# Altium schematic sheet EC800ECNNQ-N03-SNNSA1_EC800ECNNQ-N03-SNNSA.schdoc
size 127 x 152 mm
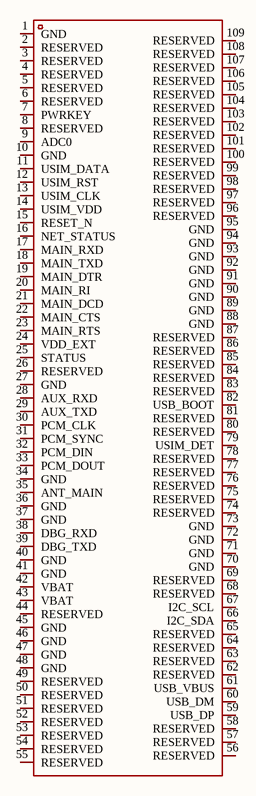
[diagram p0: EC800ECNNQ-N03-SNNSA1_EC800ECNNQ-N03-SNNSA.schdoc]

## Parts
U?  EC800ECNNQ-N03-SNNSA  [LCC-LGA-109_L17.7-W15.8-P1.10_MC661]  (value not drawn)

## Nets

Not connected (* = marked no-connect by the designer): U? 1(GND) 2(RESERVED) 3(RESERVED) 4(RESERVED) 5(RESERVED) 6(RESERVED) 7(PWRKEY) 8(RESERVED) 9(ADC0) 10(GND) 11(USIM_DATA) 12(USIM_RST) 13(USIM_CLK) 14(USIM_VDD) 15(RESET_N) 16(NET_STATUS) 17(MAIN_RXD) 18(MAIN_TXD) 19(MAIN_DTR) 20(MAIN_RI) 21(MAIN_DCD) 22(MAIN_CTS) 23(MAIN_RTS) 24(VDD_EXT) 25(STATUS) 26(RESERVED) 27(GND) 28(AUX_RXD) 29(AUX_TXD) 30(PCM_CLK) 31(PCM_SYNC) 32(PCM_DIN) 33(PCM_DOUT) 34(GND) 35(ANT_MAIN) 36(GND) 37(GND) 38(DBG_RXD) 39(DBG_TXD) 40(GND) 41(GND) 42(VBAT) 43(VBAT) 44(RESERVED) 45(GND) 46(GND) 47(GND) 48(GND) 49(RESERVED) 50(RESERVED) 51(RESERVED) 52(RESERVED) 53(RESERVED) 54(RESERVED) 55(RESERVED) 56(RESERVED) 57(RESERVED) 58(RESERVED) 59(USB_DP) 60(USB_DM) 61(USB_VBUS) 62(RESERVED) 63(RESERVED) 64(RESERVED) 65(RESERVED) 66(I2C_SDA) 67(I2C_SCL) 68(RESERVED) 69(RESERVED) 70(GND) 71(GND) 72(GND) 73(GND) 74(RESERVED) 75(RESERVED) 76(RESERVED) 77(RESERVED) 78(RESERVED) 79(USIM_DET) 80(RESERVED) 81(RESERVED) 82(USB_BOOT) 83(RESERVED) 84(RESERVED) 85(RESERVED) 86(RESERVED) 87(RESERVED) 88(GND) 89(GND) 90(GND) 91(GND) 92(GND) 93(GND) 94(GND) 95(GND) 96(RESERVED) 97(RESERVED) 98(RESERVED) 99(RESERVED) 100(RESERVED) 101(RESERVED) 102(RESERVED) 103(RESERVED) 104(RESERVED) 105(RESERVED) 106(RESERVED) 107(RESERVED) 108(RESERVED) 109(RESERVED)

## Library data of the parts
U? = EC800ECNNQ-N03-SNNSA: Manufacturer: Quectel(移远); Add into BOM: yes; Symbol: EC800ECNNQ-N03-SNNSA; Device: EC800ECNNQ-N03-SNNSA; LCSC Part Name: EC800ECNNQ-N03-SNNSA; Supplier Part: C5353976; Manufacturer Part: EC800ECNNQ-N03-SNNSA; Supplier Footprint: SMD,15.8x17.7mm; JLCPCB Part Class: Extended Part; Datasheet: https://atta.szlcsc.com/upload/public/pdf/source/20231101/6BD9B7EFACC38BE567923D640509691A.pdf; Supplier: LCSC; Convert to PCB: yes